# EAGLE design mainboard (EAGLE 7.5.0)
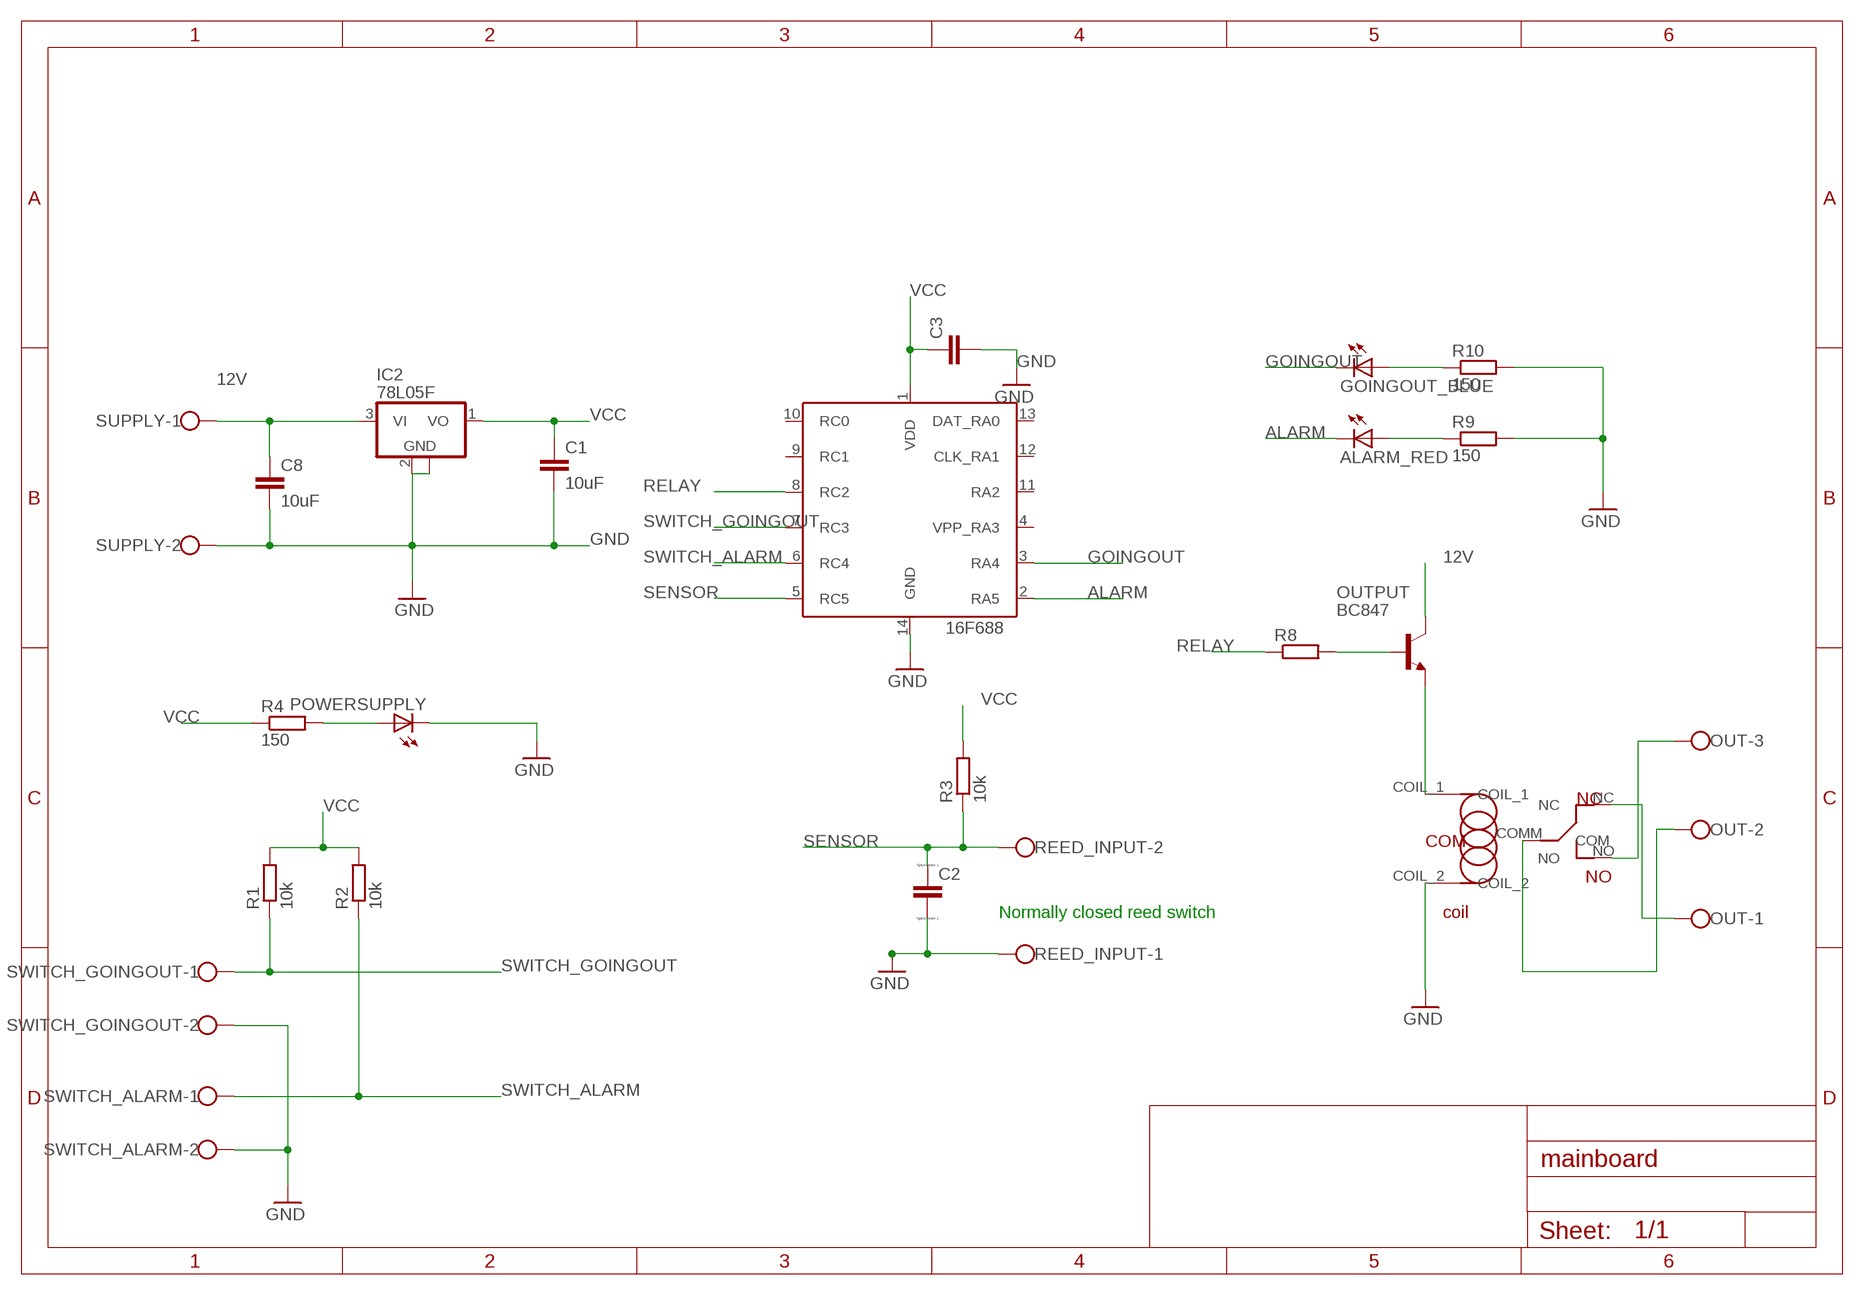
[diagram p0: schematic, sheet 1]

## Parts
ALARM_RED  LED5MM  [LED5MM]
C1  10uF  C-EUC0805  [C0805]
C2  CC0603  [C0603]
C3  C-EUC0805  [C0805]
C8  10uF  C-EUC0805  [C0805]
GOINGOUT_BLUE  LED5MM  [LED5MM]
IC2  78L05F  [SOT89]
OUT  W237-103  [W237-103]
OUTPUT  BC847  [SOT23]
POWERSUPPLY  LED5MM  [LED5MM]
R1  10k  R-EU_R0603  [R0603]
R2  10k  R-EU_R0603  [R0603]
R3  10k  R-EU_R0603  [R0603]
R4  150  R-EU_R0603  [R0603]
R8  R-EU_R0603  [R0603]
R9  150  R-EU_R0603  [R0603]
R10  150  R-EU_R0603  [R0603]
REED_INPUT  W237-102  [W237-102]
SUPPLY  W237-102  [W237-102]
SWITCH_ALARM  W237-102  [W237-102]
SWITCH_GOINGOUT  W237-102  [W237-102]
U$1  PIC16F688SOIC14  [SOIC14]
U$2  JQC-3FC_RELAY  [JQC-3FC]

## Nets
12V: C8.1 IC2.3(VI) OUTPUT.3(C) SUPPLY.1
ALARM: ALARM_RED.K(C) U$1.2(RA5)
GND: C1.2 C2.2 C3.2 C8.2 IC2.2(GND) IC2.2@1(GND) POWERSUPPLY.K(C) R9.2 R10.2 REED_INPUT.1 SUPPLY.2 SWITCH_ALARM.2 SWITCH_GOINGOUT.2 U$1.14(GND) U$2.COIL_2
GOINGOUT: GOINGOUT_BLUE.K(C) U$1.3(RA4)
N$1: OUTPUT.2(E) U$2.COIL_1
N$2: GOINGOUT_BLUE.A R10.1
N$3: POWERSUPPLY.A R4.2
N$4: OUTPUT.1(B) R8.2
N$5: ALARM_RED.A R9.1
N$6: OUT.1 U$2.NC
N$8: OUT.3 U$2.NO
N$9: OUT.2 U$2.COMM(COM)
RELAY: R8.1 U$1.8(RC2)
SENSOR: C2.1 R3.1 REED_INPUT.2 U$1.5(RC5)
SWITCH_ALARM: R2.1 SWITCH_ALARM.1 U$1.6(RC4)
SWITCH_GOINGOUT: R1.1 SWITCH_GOINGOUT.1 U$1.7(RC3)
VCC: C1.1 C3.1 IC2.1(VO) R1.2 R2.2 R3.2 R4.1 U$1.1(VDD)
Unconnected: U$1.4(VPP_RA3) U$1.9(RC1) U$1.10(RC0) U$1.11(RA2) U$1.12(CLK_RA1) U$1.13(DAT_RA0)

## Notes on the sheet
- Normally closed reed switch

## Library data of the parts
ALARM_RED GOINGOUT_BLUE POWERSUPPLY = led:LED: LED OSRAM: - CHIPLED LG R971, LG N971, LY N971, LG Q971, LY Q971, LO R971, LY R971 LH N974, LH R974 LS Q976, LO Q976, LY Q976 LO Q996 - Hyper CHIPLED LW Q18S LB Q993, LB Q99A, LB R99A - SideLED LS A670, LO A670, LY A670, LG A670, LP A670 LB A673, LV A673, LT A673, LW A673 LH A674 LY A675 LS A676, LA A676, LO A676, LY A676, LW A676 LS A679, LY A679, LG A679 - Hyper Micro SIDELED® LS Y876, LA Y876, LO Y876, LY Y876 LT Y87S - SmartLED LW L88C, LW L88S LB L89C, LB L89S, LG L890 LS L89K, LO L89K, LY L89K LS L896, LA L896, LO L896, LY L896 - TOPLED LS T670, LO T670, LY T670, LG T670, LP T670 LSG T670, LSP T670, LSY T670, LOP T670, LYG T670 LG T671, LOG T671, LSG T671 LB T673, LV T673, LT T673, LW T673 LH T674 LS T676, LA T676, LO T676, LY T676, LB T676, LH T676, LSB T676, LW T676 LB T67C, LV T67C, LT T67C, LS T67K, LO T67K, LY T67K, LW E67C LS E67B, LA E67B, LO E67B, LY E67B, LB E67C, LV E67C, LT E67C LW T67C LS T679, LY T679, LG T679 LS T770, LO T770, LY T770, LG T770, LP T770 LB T773, LV T773, LT T773, LW T773 LH T774 LS E675, LA E675, LY E675, LS T675 LS T776, LA T776, LO T776, LY T776, LB T776 LHGB T686 LT T68C, LB T68C - Hyper Mini TOPLED® LB M676 - Mini TOPLED Santana® LG M470 LS M47K, LO M47K, LY M47K Source: http://www.osram.convergy.de LUXEON: - LUMILED® LXK2-PW12-R00, LXK2-PW12-S00, LXK2-PW14-U00, LXK2-PW14-V00 LXK2-PM12-R00, LXK2-PM12-S00, LXK2-PM14-U00 LXK2-PE12-Q00, LXK2-PE12-R00, LXK2-PE12-S00, LXK2-PE14-T00, LXK2-PE14-U00 LXK2-PB12-K00, LXK2-PB12-L00, LXK2-PB12-M00, LXK2-PB14-N00, LXK2-PB14-P00, LXK2-PB14-Q00 LXK2-PR12-L00, LXK2-PR12-M00, LXK2-PR14-Q00, LXK2-PR14-R00 LXK2-PD12-Q00, LXK2-PD12-R00, LXK2-PD12-S00 LXK2-PH12-R00, LXK2-PH12-S00 LXK2-PL12-P00, LXK2-PL12-Q00, LXK2-PL12-R00 Source: www.luxeon.com KINGBRIGHT: KA-3528ASYC Source: www.kingbright.com
C1 C3 C8 = rcl:C-EU: CAPACITOR, European symbol
C2 = eagle-ltspice:C: CAPACITOR, European symbol; SPICEMODEL: NONE; SPICEPREFIX: C
IC2 = linear:78L*: POSITOIV-VOLTAGE REGULATORS Output up to 100 mA Source: Datasheet <http://focus.ti.com/lit/ds/symlink/ua78l05.pdf>
OUT = con-wago-500:W237-103: WAGO SCREW CLAMP; MPN: 237-103; OC_FARNELL: unknown; OC_NEWARK: 18M7116
OUTPUT = transistor:BC847: NPN TRANSISTOR
R1-R4 R8-R10 = rcl:R-EU_: RESISTOR, European symbol
REED_INPUT SUPPLY SWITCH_ALARM SWITCH_GOINGOUT = con-wago-500:W237-102: WAGO SCREW CLAMP; MPN: 237-102; OC_FARNELL: unknown; OC_NEWARK: 70K9898
U$1 = microchip-16f688:PIC16F688
U$2 = JQC-3FC_relay:JQC-3FC_RELAY

## Board
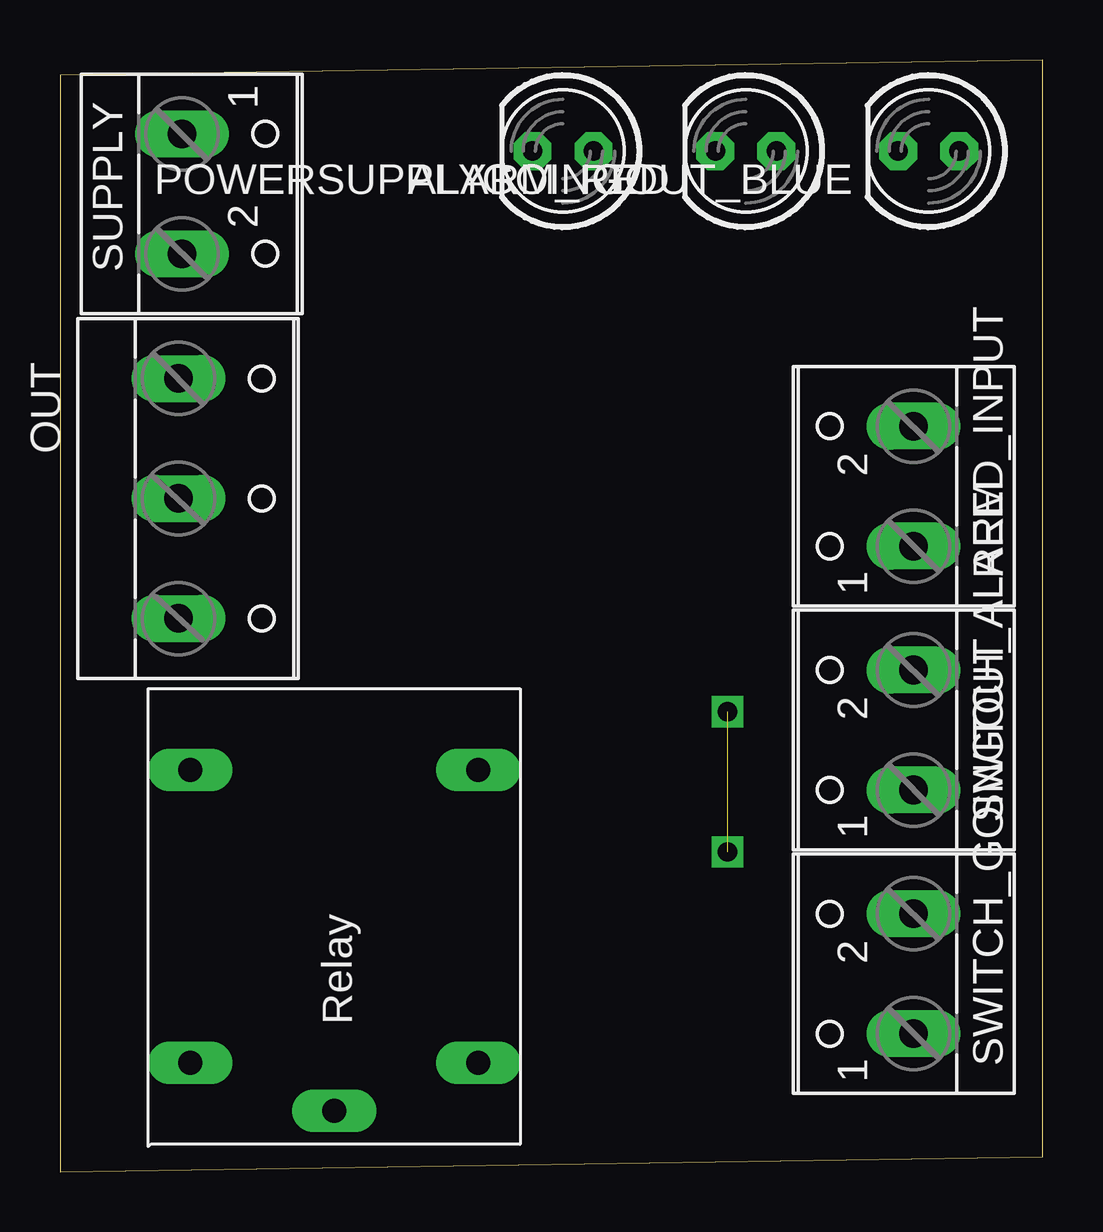
[diagram p1: board, top side]
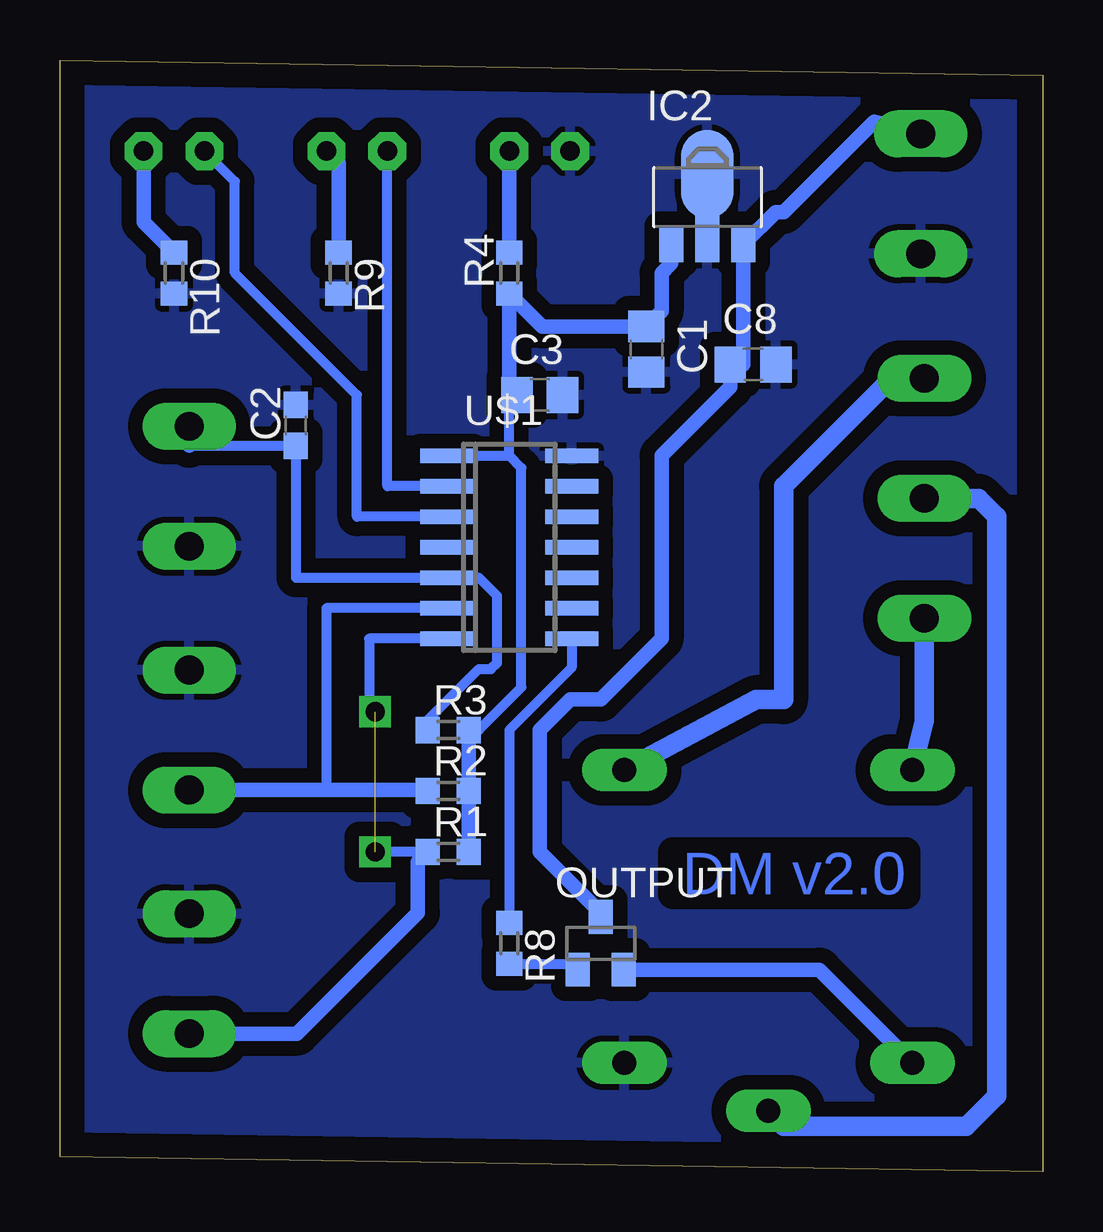
[diagram p2: board, bottom side, seen from below]

Size 40.95 x 46.34 mm. Coordinates in mm from the lower left corner, seen from the top.
Outline: 0,0 40.95,0.64 40.95,46.34 0,45.71 0,0
Copper layers (1*16): Top 0.035mm / dielectric 1.5mm / Bottom 0.035mm
Design rules "default *": minimum track width 10mil, minimum drill 24mil, track to track 8mil, track to pad 8mil, pad to pad 8mil, via to via 8mil, smd to smd 8mil, copper to edge 40mil, drill to drill 10mil, minimum pad ring 15mil, minimum via ring 10mil, stop-mask expansion 4mil, vias tented up to drill 0mil, thermal gap 10mil

### Footprints (pad centres in the part's own frame; a part is rotated, then mirrored left to right if it is on the bottom)
LED5MM = drill 0.813 octagon: A -1.27,0; K 1.27,0
C0805 = smd 1.3 x 1.5: 1 -0.95,0; 2 0.95,0
C0603 = smd 1.1 x 1: 1 -0.85,0; 2 0.85,0
SOT89 = smd 1 x 1.5: 1 -1.499,-1.981; 3 1.499,-1.981 | smd 1 x 2: 2 0,-1.727 | smd 2.2 x 3.7: 2@1 0,0.94
W237-103 = drill 1.194 long: 1 -5,-1.29; 2 0,-1.29; 3 5,-1.29
SOT23 = smd 1 x 1.4: 1 -0.95,-1.1; 2 0.95,-1.1; 3 0,1.1
R0603 = smd 1 x 1.1: 1 -0.85,0; 2 0.85,0
W237-102 = drill 1.194 long: 1 -2.5,-1.27; 2 2.5,-1.27
SOIC14 = smd 0.6 x 2.2: 1 -3.81,-2.6; 2 -2.54,-2.6; 3 -1.27,-2.6; 4 0,-2.6; 5 1.27,-2.6; 6 2.54,-2.6; 7 3.81,-2.6; 8 3.81,2.6; 9 2.54,2.6; 10 1.27,2.6; 11 0,2.6; 12 -1.27,2.6; 13 -2.54,2.6; 14 -3.81,2.6
JQC-3FC = drill 1 pad 1.422 long: COIL_1 3.4,13.75; COIL_2 3.4,1.75; COMM 1.4,7.75; NC 15.6,1.75; NO 15.6,13.75

### Placement (x,y rotation side)
ALARM_RED  28.58,42.55 180 top
C1  16.51,34.29 270 bottom
C2  31.12,31.11 90 bottom
C3  20.96,32.39 0 bottom
C8  12.06,33.66 0 bottom
GOINGOUT_BLUE  36.2,42.55 180 top
IC2  13.97,40.64 0 bottom
OUT  6.22,28.07 270 top
OUTPUT  18.42,9.53 0 bottom
POWERSUPPLY  20.96,42.55 180 top
R1  24.77,13.33 0 bottom
R2  24.77,15.87 0 bottom
R3  24.77,18.42 0 bottom
R4  22.23,37.47 90 bottom
R8  22.23,9.53 270 bottom
R9  29.34,37.47 270 bottom
R10  36.2,37.47 270 bottom
REED_INPUT  34.29,28.57 90 top
SUPPLY  6.35,40.77 270 top
SWITCH_ALARM  34.29,18.42 90 top
SWITCH_GOINGOUT  34.29,8.25 90 top
U$1  22.23,26.04 270 bottom
U$2  19.18,1.14 90 top

### Tracks (layer width: path | path; a pad name or v marks a point on that pad's centre or on a via)
12V
  Bottom 0.61: SUPPLY.1 7.02,43.78 10.79,40.01 11.12,40.01 IC2.3 12.47,33.66 C8.1 13.02,32.7 15.88,29.85 15.88,22.22 18.42,19.68 19.69,19.68 20.96,18.42 20.96,13.33 18.42,10.79 OUTPUT.3
ALARM
  Bottom 0.406: U$1.2 27.31,28.57 ALARM_RED.K
GND
  pour Bottom (isolate 0.61): 1.27,46.36 41.27,46.36 41.27,0.64 1.27,0.64
GOINGOUT
  Bottom 0.406: U$1.3 28.58,27.31 28.58,32.39 33.66,37.47 33.66,41.28 GOINGOUT_BLUE.K
N$1
  Bottom 0.61: OUTPUT.2 9.31,8.43 U$2.COIL_1
N$2
  Bottom 0.61: R10.1 37.46,39.59 GOINGOUT_BLUE.A
N$3
  Bottom 0.61: R4.2 POWERSUPPLY.A
N$4
  Bottom 0.406: R8.2 19.62,8.68 OUTPUT.1
N$5
  Bottom 0.61: R9.1 29.34,42.04 ALARM_RED.A
N$6
  Bottom 0.813: OUT.1 6.3,33.07 10.79,28.57 10.79,19.68 11.95,19.68 U$2.NC
N$8
  Bottom 0.813: OUT.3 4.93,18.79 U$2.NO
N$9
  Bottom 0.813: OUT.2 2.67,28.07 1.91,27.31 1.91,3.18 3.17,1.91 10.79,1.91 U$2.COMM
N$10  (via drill 0.8)
  other vias: 27.81,19.18
RELAY
  Bottom 0.406: U$1.8 19.62,21.01 22.23,18.42 R8.1
SENSOR
  Bottom 0.406: R3.1 25.62,18.83 23.5,20.96 22.99,20.96 22.73,21.21 22.73,24 23.5,24.76 U$1.5 31.12,24.76 C2.1 35.56,30.26
  Bottom 0.61: 35.56,30.26 REED_INPUT.2
SWITCH_ALARM
  Bottom 0.406: U$1.6 29.85,23.5 29.85,15.92
  Bottom 0.61: SWITCH_ALARM.1 29.85,15.92 25.66,15.92 R2.1
SWITCH_GOINGOUT  (via drill 0.8)  (1 unrouted)
  Bottom 0.406: U$1.7 28.07,22.22 28.07,19.43 27.81,19.18 | R1.1 v27.81,13.33
  Bottom 0.61: SWITCH_GOINGOUT.1 31.08,5.75 26.04,10.79 26.04,12.92 R1.1
VCC
  Bottom 0.406: R3.2 23.5,18.42 21.72,20.19 21.72,29.34 22.23,29.85 | 22.23,29.85 22.23,32.06 C3.1 | U$1.1 22.23,29.85
  Bottom 0.61: IC2.1 15.47,37.87 15.88,37.47 15.88,35.88 C1.1 20.85,35.24 R4.1 22.23,32.7 C3.1 | R1.2 R2.2 R3.2

### Text on the board
Bottom: DM v2.0